# EAGLE design relays (EAGLE 6.6.0)
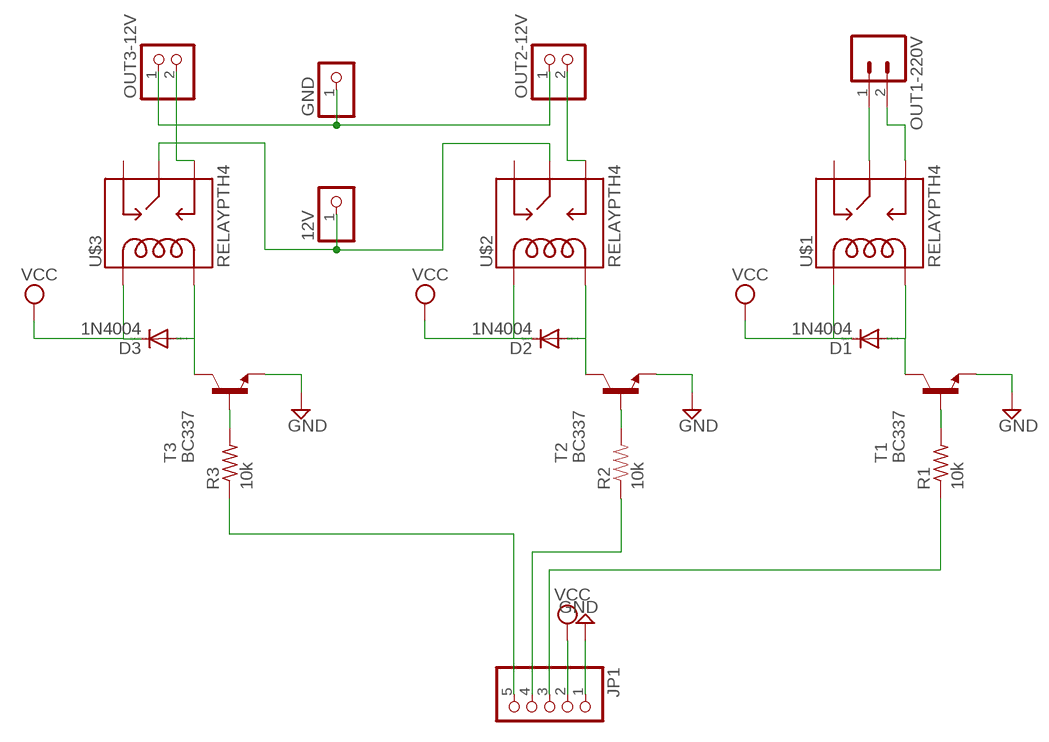
[diagram p0: schematic, sheet 1]

## Parts
12V  PINHD-1X1  [1X01]
D1  1N4004  [DO41-10]
D2  1N4004  [DO41-10]
D3  1N4004  [DO41-10]
GND  PINHD-1X1  [1X01]
JP1  PINHD-1X5  [1X05]
OUT1-220V  M025MM  [SCREWTERMINAL-5MM-2]
OUT2-12V  PINHD-1X2  [1X02]
OUT3-12V  PINHD-1X2  [1X02]
R1  10k  R-US_0207/15  [0207/15]
R2  10k  10KOHM-1/4W5%(PTH)VERT  [AXIAL-0.1]
R3  10k  R-US_0207/15  [0207/15]
T1  BC337  [TO92]
T2  BC337  [TO92]
T3  BC337  [TO92]
U$1  RELAYPTH4  [RELAY-JZC]
U$2  RELAYPTH4  [RELAY-JZC]
U$3  RELAYPTH4  [RELAY-JZC]

## Nets
GND: JP1.1 T1.1(E) T2.1(E) T3.1(E)
N$1: D3.A T3.3(C) U$3.1(COIL2)
N$2: OUT1-220V.1 U$1.4(MAIN)
N$3: D2.A T2.3(C) U$2.1(COIL2)
N$5: D1.A T1.3(C) U$1.1(COIL2)
N$7: R1.2 T1.2(B)
N$8: R2.P$2 T2.2(B)
N$9: R3.2 T3.2(B)
N$10: JP1.3 R1.1
N$11: JP1.4 R2.P$1
N$12: JP1.5 R3.1
N$14: OUT1-220V.2 U$1.3(NO)
N$15: 12V.1 U$2.4(MAIN) U$3.4(MAIN)
N$16: OUT3-12V.2 U$3.3(NO)
N$17: OUT2-12V.2 U$2.3(NO)
N$18: GND.1 OUT2-12V.1 OUT3-12V.1
VCC: D1.C D2.C D3.C JP1.2 U$1.5(COIL1) U$2.5(COIL1) U$3.5(COIL1)
Unconnected: U$1.2(NC) U$2.2(NC) U$3.2(NC)

## Library data of the parts
12V GND = pinhead:PINHD-1X1: PIN HEADER
D1-D3 = diode:1N4004: DIODE general purpose rectifier, 1 A
JP1 = pinhead:PINHD-1X5: PIN HEADER
OUT1-220V = SparkFun-Connectors:M02: Standard 2-pin 0.1" header. Use with - straight break away headers ( PRT-00116) - right angle break away headers (PRT-00553) - swiss pins (PRT-00743) - machine pins (PRT-00117) - female headers (PRT-00115) Molex polarized connector foot print use with: PRT-08233 with associated crimp pins and housings. 2.54_SCREWTERM for use with PRT-10571. 3.5mm Screw Terminal footprints for PRT-08084 5mm Screw Terminal footprints for use with PRT-08432; STOREFRONT_ID: PRT-08432
OUT2-12V OUT3-12V = pinhead:PINHD-1X2: PIN HEADER
R1 R3 = resistor:R-US_: RESISTOR, American symbol
R2 = SparkFun-Resistors:10KOHM-1/4W5%(PTH): RES-09435; PROD_ID: RES-9435
T1-T3 = transistor:BC337: NPN TRANSISTOR
U$1-U$3 = SparkFun-Electromechanical:RELAY: SPDT relay (COM-00101)

## Board
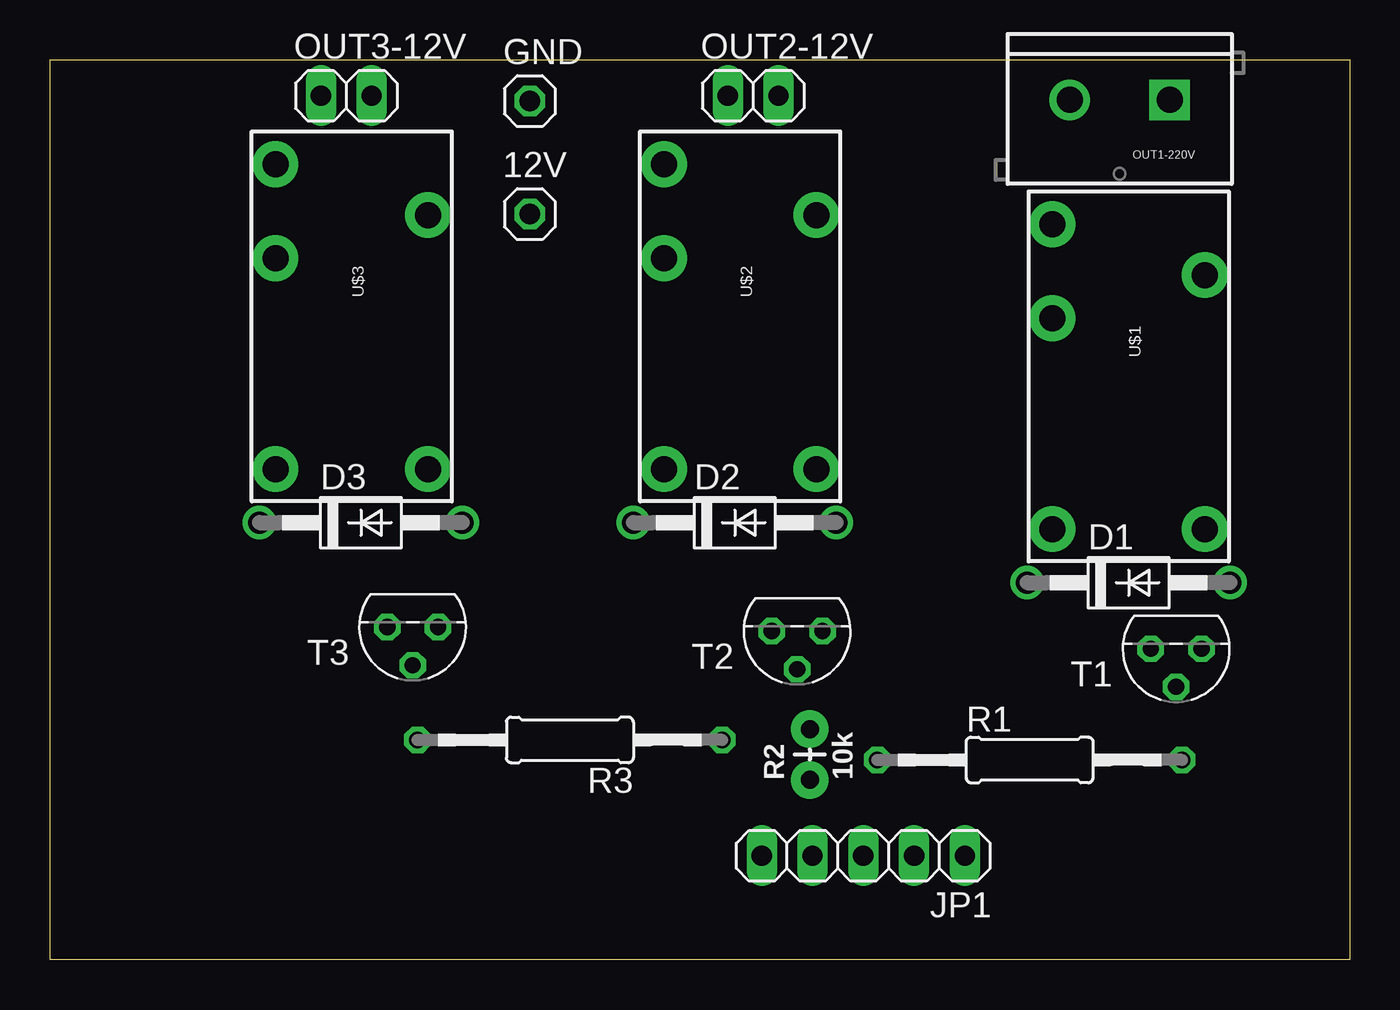
[diagram p1: board, top side]
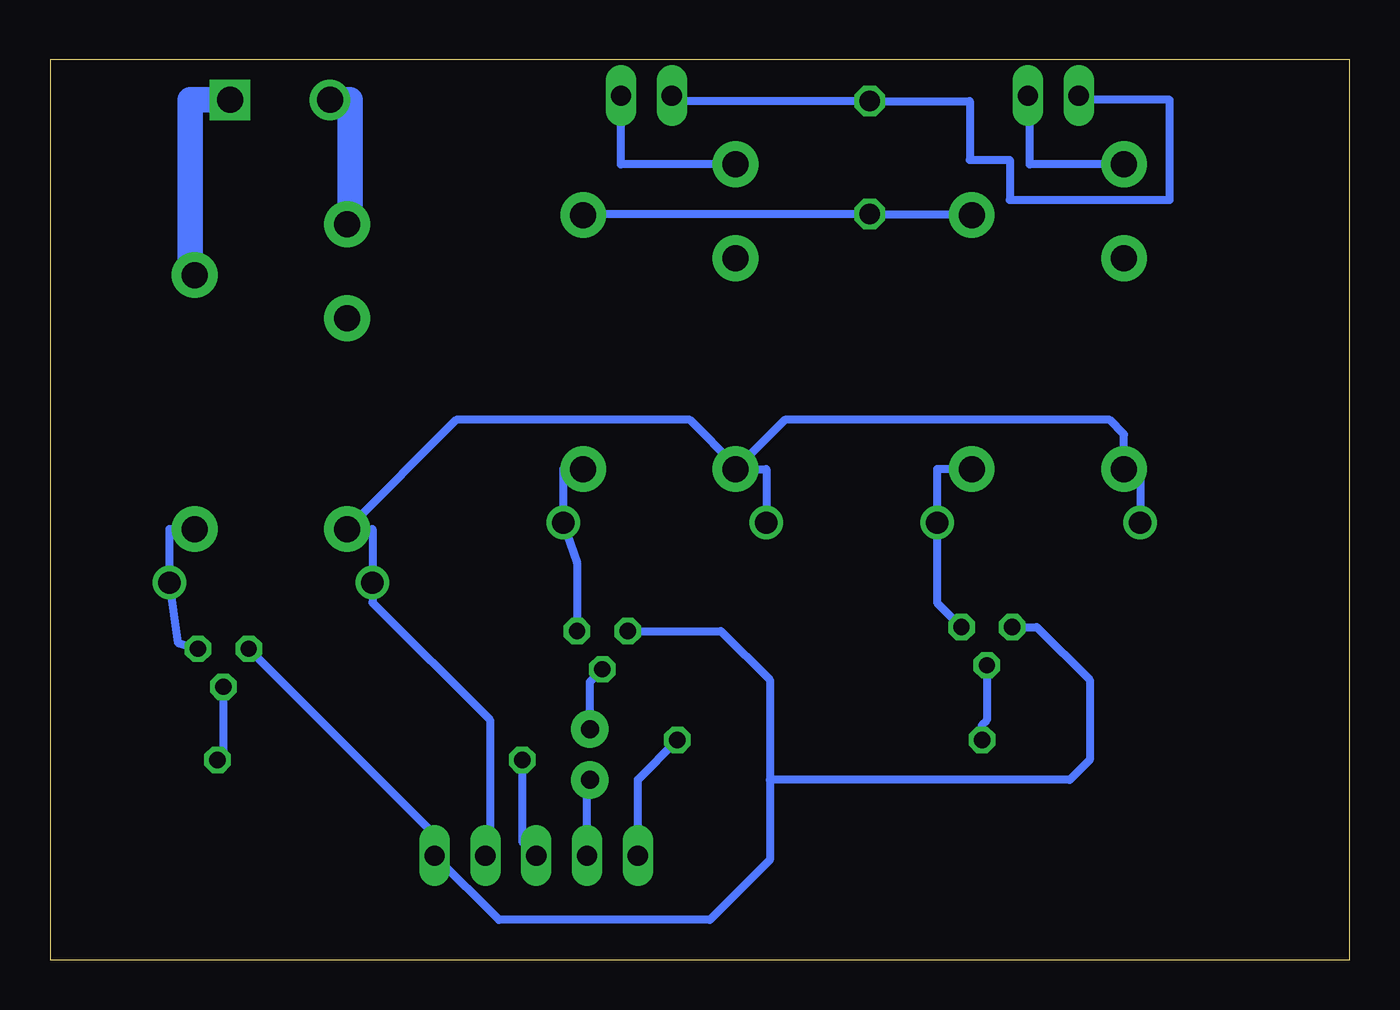
[diagram p2: board, bottom side, seen from below]

Size 65 x 45 mm. Coordinates in mm from the lower left corner, seen from the top.
Outline: 0,45 65,45 65,0 0,0 0,45
Copper layers (1*16): Top 0.035mm / dielectric 1.5mm / Bottom 0.035mm
Design rules "default": minimum track width 10mil, minimum drill 24mil, track to track 8mil, track to pad 8mil, pad to pad 8mil, via to via 8mil, smd to smd 8mil, copper to edge 40mil, drill to drill 8mil, minimum pad ring 10mil, minimum via ring 8mil, stop-mask expansion 4mil, vias tented up to drill 0mil, thermal gap 10mil

### Footprints (pad centres in the part's own frame; a part is rotated, then mirrored left to right if it is on the bottom)
1X01 = drill 1.016 octagon: 1 0,0
DO41-10 = drill 1.118: A 5.08,0; C -5.08,0
1X05 = drill 1.016 long: 1 -5.08,0; 2 -2.54,0; 3 0,0; 4 2.54,0; 5 5.08,0
SCREWTERMINAL-5MM-2 = drill 1.3 pad 2.032 square: 1 0,0 | drill 1.3 pad 2.032: 2 5,0
1X02 = drill 1.016 long: 1 -1.27,0; 2 1.27,0
0207/15 = drill 0.813 octagon: 1 -7.62,0; 2 7.62,0
AXIAL-0.1 = drill 0.9 pad 1.88: P$1 0,0; P$2 2.54,0
TO92 = drill 0.813 octagon: 1 1.27,0; 2 0,1.905; 3 -1.27,0
RELAY-JZC = drill 1.3 pad 2.286: 1 3.81,-8.89; 2 -3.81,1.651; 3 -3.81,6.35; 4 3.81,3.81; 5 -3.81,-8.89

### Placement (x,y rotation side)
12V  24,37.29 0 top
D1  53.95,18.86 0 top
D2  34.25,21.86 0 top
D3  15.55,21.86 0 top
GND  24,42.94 0 top
JP1  40.68,5.21 180 top
OUT1-220V  56,43 180 top
OUT2-12V  35.17,43.21 0 top
OUT3-12V  14.82,43.21 0 top
R1  49,10 0 top
R2  38,9 90 top
R3  26,11 180 top
T1  56.33,15.56 180 top
T2  37.37,16.44 180 top
T3  18.14,16.64 180 top
U$1  53.95,30.43 0 top
U$2  34.52,33.43 0 top
U$3  15.09,33.43 0 top

### Tracks (layer width: path | path; a pad name or v marks a point on that pad's centre or on a via)
GND
  Bottom 0.406: T1.1 45.76,6.26 JP1.1 42.55,2 32,2 29,5 29,9 | T2.1 31.44,16.44 29,14 29,9 | T3.1 15.64,16.64 13,14 13,10 14,9 29,9
N$1
  Bottom 0.406: U$3.1 20.63,24.54 D3.A 20.63,17.86 T3.3
N$2
  Bottom 1.27: OUT1-220V.1 58,43 58,34.48 U$1.4
N$3
  Bottom 0.406: U$2.1 39.33,24.54 D2.A 38.64,19.86 T2.3
N$5
  Bottom 0.406: U$1.1 59.03,21.54 D1.A 58.6,15.86 T1.3
N$7
  Bottom 0.406: T1.2 56.33,10.29 R1.2
N$8
  Bottom 0.406: R2.P$2 38,13.9 T2.2
N$9
  Bottom 0.406: T3.2 18.14,11.99 18.38,11.75 R3.2
N$10
  Bottom 0.406: R1.1 41.38,5.91 JP1.3
N$11
  Bottom 0.406: JP1.4 38.14,8.86 R2.P$1
N$12
  Bottom 0.406: JP1.5 35.6,9.02 R3.1
N$14
  Bottom 1.27: OUT1-220V.2 50,43 50,36.92 U$1.3
N$15
  Bottom 0.406: U$3.4 18.9,37.29 12V.1 38.33,37.29 U$2.4
N$16
  Bottom 0.406: U$3.3 16,39.78 16,43 16.09,43 OUT3-12V.2
N$17
  Bottom 0.406: U$2.3 36.44,39.78 OUT2-12V.2
N$18
  Bottom 0.406: OUT2-12V.1 33.9,42.94 GND.1 19,42.94 19,40 17,40 17,38 9,38 9,43 13.55,43 OUT3-12V.1
VCC
  Bottom 0.406: U$2.5 29.17,24.54 D2.C | D3.C 10.47,24.54 U$3.5 11.28,26.28 12,27 28.25,27 U$2.5 | U$2.5 30.71,24.71 33,27 44.68,27 U$1.5 48.87,21.54 D1.C 48.87,17.87 43,12 43,5.43 JP1.2